# Altium project Intermediate_LCL_Updated.PrjPcb
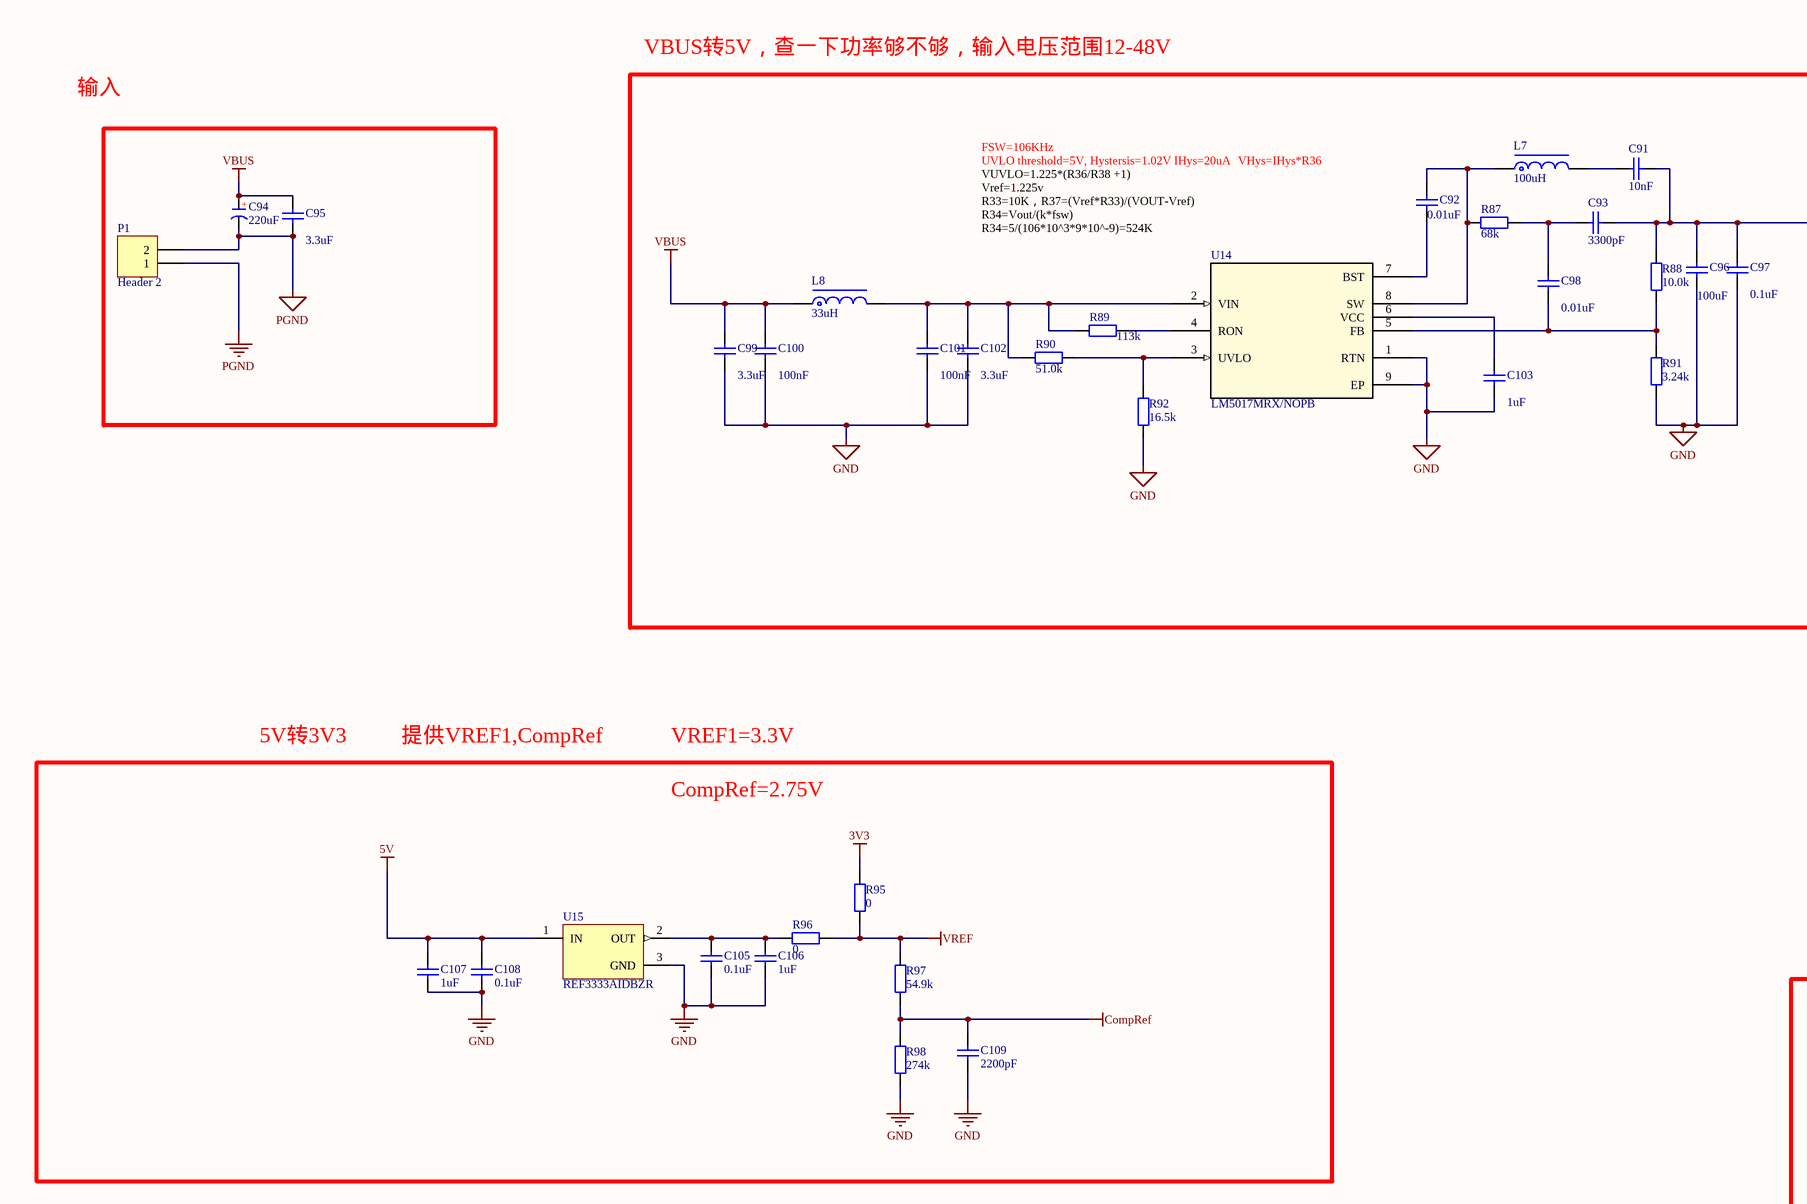
[diagram p0: power.SchDoc, left]
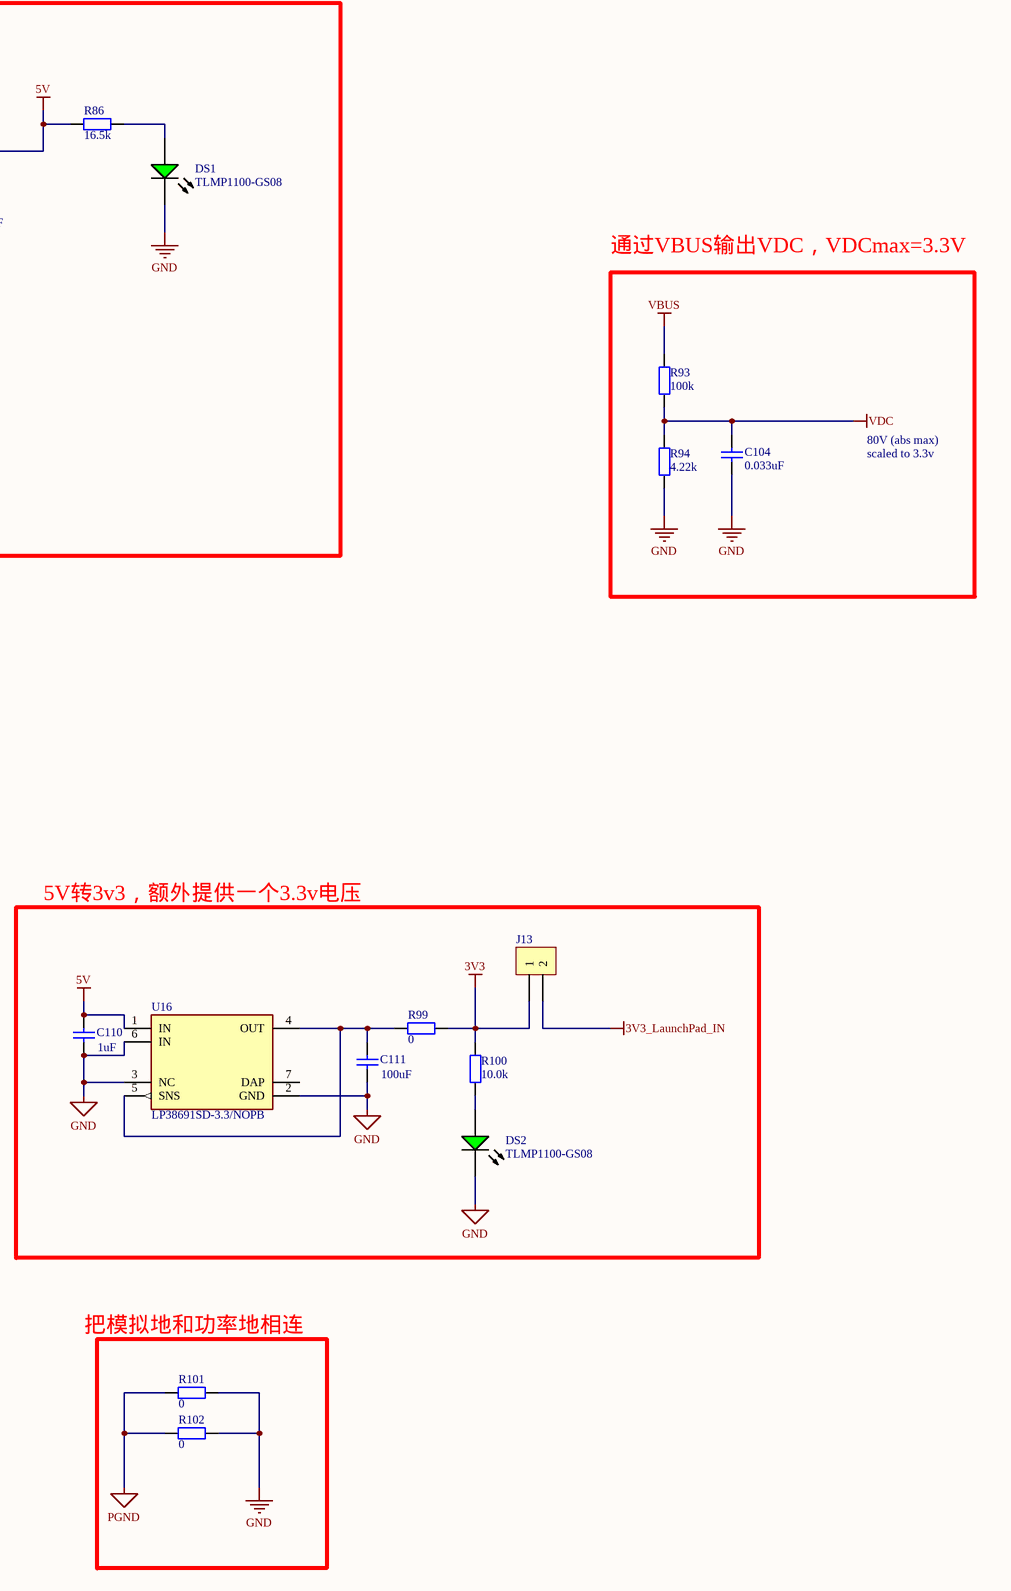
[diagram p1: power.SchDoc, right]
5 sheets, 482 parts. Net scope: hierarchical (ports join the sheet entries above them; power ports are global).
Board file: mini-inverter.PcbDoc
Sheets:
  power.SchDoc
  protection.SchDoc
  pwm-enable.SchDoc
  mini-inverter.SchDoc
    Inverter?1 = bridge.SchDoc
    Inverter?2 = bridge.SchDoc
    Inverter?3 = bridge.SchDoc
    Inverter?1 = bridge.SchDoc
    Inverter?2 = bridge.SchDoc
    Inverter?3 = bridge.SchDoc

## Sheet power.SchDoc
size A2

### Parts
(Parts that share a designator on the sheet are numbered #1, #2 ... from top to bottom, then left to right.)
C91  10nF  [CAPC1608X06N]
C92  0.01uF  [CAPC1608X06N]
C93  3300pF  [CAPC1608X06N]
C94  220uF  [CAP 1.5*4*8]
C95  3.3uF  [CAPC1608X06N]
C96  100uF  [CAPC1608X06N]
C97  0.1uF  [CAPC1608X06N]
C98  0.01uF  [CAPC1608X06N]
C99  3.3uF  [CAPC1608X06N]
C100  100nF  [CAPC1608X06N]
C101  100nF  [CAPC1608X06N]
C102  3.3uF  [CAPC1608X06N]
C103  1uF  [CAPC1608X06N]
C104  0.033uF  [CAPC1608X06N]
C105  0.1uF  [CAPC1608X06N]
C106  1uF  [CAPC1608X06N]
C107  1uF  [CAPC1608X06N]
C108  0.1uF  [CAPC1608X06N]
C109  2200pF  [CAPC1608X06N]
C110  1uF  [CAPC1608X06N]
C111  100uF  [CAPC1608X06N]
DS1  TLMP1100-GS08  [VISH-TLMX1100_V]
DS2  TLMP1100-GS08  [VISH-TLMX1100_V]
J13  CON2  [DG1282-5.0]  (value not drawn)
L7  100uH  [NR4018]
L8  33uH  [NR2520]
P1  Header 2  [HDR1X2]
R86  16.5k  [RESC1608X05N]
R87  68k  [RESC1608X05N]
R88  10.0k  [RESC1608X05N]
R89  113k  [RESC1608X05N]
R90  51.0k  [RESC1608X05N]
R91  3.24k  [RESC1608X05N]
R92  16.5k  [RESC1608X05N]
R93  100k  [RESC1608X05N]
R94  4.22k  [RESC1608X05N]
R95  0  [RESC1608X05N]
R96  0  [RESC1608X05N]
R97  54.9k  [RESC1608X05N]
R98  274k  [RESC1608X05N]
R99  0  [RESC1608X05N]
R100  10.0k  [RESC1608X05N]
R101  0  [RESC1608X05N]
R102  0  [RESC1608X05N]
U14  LM5017MRX/NOPB  [DDA8_3P1X2P41]
U15#1  REF3333AIDBZR  [DBZ0003A_L]
U16  LP38691SD-3.3/NOPB  [FP-NGG0006A-MFG]

### Nets
3V3: J13.1 R95.2 R99.2 R100.2
3V3_LaunchPad_IN: J13.2
5V: C91.2 C93.1 C96.2 C97.2 C107.1 C108.1 C110.2 R86.2 R88.2 U15#1.1(IN) U16.1(IN)
CompRef: C109.1 R97.1 R98.2
GND: C96.1 C97.1 C99.2 C100.2 C101.2 C102.1 C103.1 C104.2 C105.2 C106.2 C107.2 C108.2 C109.2 C110.1 C111.1 DS1.2(K) DS2.2(K) R91.1 R92.1 R94.1 R98.1 R101.1 R102.1 U14.1(RTN) U14.9(EP) U15#1.3(GND) U16.2(GND) U16.3(NC) U16.6(IN)
PGND: C94.2(K) C95.1 P1.1 P1.2 R101.2 R102.2
VBUS: C94.1(A) C95.2 C99.1 C100.1 L8.1 R93.2
VDC: C104.1 R93.1 R94.2
VREF: R95.1 R96.2 R97.2
NetC91_1: C91.1 L7.2
NetC92_1: C92.1 U14.7(BST)
NetC92_2: C92.2 L7.1 R87.2 U14.8(SW)
NetC93_2: C93.2 C98.2 R87.1
NetC98_1: C98.1 R88.1 R91.2 U14.5(FB)
NetC101_1: C101.1 C102.2 L8.2 R89.1 R90.1 U14.2(VIN)
NetC103_2: C103.2 U14.6(VCC)
NetC105_1: C105.1 C106.1 R96.1 U15#1.2(OUT)
NetC111_2: C111.2 R99.1 U16.4(OUT) U16.5(SNS)
NetDS1_1: DS1.1(A) R86.1
NetDS2_1: DS2.1(A) R100.1
NetR89_2: R89.2 U14.4(RON)
NetR90_2: R90.2 R92.2 U14.3(UVLO)

Not connected (* = marked no-connect by the designer): U16 7(DAP)

### Notes on the sheet
- VBUS转5V，查一下功率够不够，输入电压范围12-48V
- 输入
- FSW=106KHz
- UVLO threshold=5V, Hystersis=1.02V IHys=20uA
- Vref=1.225v
- R33=10K，R37=(Vref*R33)/(VOUT-Vref)
- R34=Vout/(k*fsw)
- VUVLO=1.225*(R36/R38 +1)
- VHys=IHys*R36
- R34=5/(106*10^3*9*10^-9)=524K
- 通过VBUS输出VDC，VDCmax=3.3V
- 80V (abs max)
- scaled to 3.3v
- 5V转3V3
- 提供VREF1,CompRef
- VREF1=3.3V
- CompRef=2.75V
- 5V转3v3，额外提供一个3.3v电压
- 把模拟地和功率地相连
- (in symbol CE) +

### Library data of the parts
C91-C93 C95-C111 = Cap: Capacitor; Published: 8-Jun-2000; LatestRevisionDate: 17-Jul-2002; LatestRevisionNote: Re-released for DXP Platform.; PackageReference: RAD-0.3; Publisher: Altium Limited; PackageDescription: Radial Cap, Thru-Hole; 2 Leads; 0.3 in Pin Spacing
  C91: Value: 10nF
  C92 C98: Value: 0.01uF
  C93: Value: 3300pF
  C95 C99 C102: Value: 3.3uF
  C96 C111: Value: 100uF
  C97 C105 C108: Value: 0.1uF
  C100 C101: Value: 100nF
  C103 C106 C107 C110: Value: 1uF
  C104: Value: 0.033uF
  C109: Value: 2200pF
C94 = CE: 直插电解电容; 淘宝ID: 封装库来自淘宝 ID：黄晶宝石; BOM名称: 直插电解电容; 联系售后: https://shop463601444.taobao.com
DS1 DS2 = CMP-1666-00027-1_1: LED, RED, 2.1 V, -40 to 100 degC, 2-Pin SMD (0603), RoHS, Tape and Reel; Type (Capacitors): C0G; Resistance: 100000000000 Ohm; Capacitance: 12 pF; Voltage Rating: 50 V; Tolerance: 5%; Min Operating Temperature: -55degC; REACH SVHC: No SVHC; ComponentLink2Description: Datasheet; ComponentLink1URL: http://www.vishay.com/; Width: 0.8 mm; Package Quantity: 4000; PackageReference: TLMX1100; ComponentLink2URL: http://www.vishay.com/docs/83173/tlmb1100.pdf; Case/Package: 0603; Case Code (Metric): 1608; Packaging: Tape and Reel; Pins: 2; ComponentLink1Description: Manufacturer URL; Max Operating Temperature: 125degC; Height: 0.8 mm; Length: 1.6 mm; Mount: Surface Mount; PackageDescription: 2-Pin Surface Mount Device, Body 1.6 x 0.8 mm; DatasheetVersion: Rev. 2.7, 03/2016; Case Code (Imperial): 0603; Voltage Rating (DC): 50 V; RoHSCompliant: True; Radiation Hardening: No
L7 L8 = L-NR: NR磁胶电感; 版权归属: 来自淘宝 ID：黄晶宝石; BOM名称: NR磁胶电感; 联系售后: https://shop463601444.taobao.com
P1 = Header 2: Header, 2-Pin; LatestRevisionDate: 17-Jul-2002; LatestRevisionNote: Re-released for DXP Platform.; Publisher: Altium Limited
R86-R102 = 0603 100KΩ (1003) 1%_4: 贴片电阻; Value: 1MΩ(1%); ComponentLink1Description: 供应商链接; ComponentLink1URL: http://www.szlcsc.com/product/details_26546.html; Package: 0603; Supplier: LC; SuppliersPartNumber: C25803
U14 = LM5017MRXNOPB: No Description Available; Mfr_Name: Texas Instruments; Copyright: Copyright (C) 2024 Ultra Librarian. All rights reserved.; Manufacturer_Part_Number: LM5017MRX/NOPB; RefDes: RefDes; Type: DEV
U15#1 = CMP-0367-00146-2: 30 ppm / degC Drift, 3.9 uA Voltage Reference, -40 to 125 degC, 3-pin SOT-23 (DBZ), Green (RoHS & no Sb/Br); Manufacturer: Texas Instruments; Temp Coeff(Typ)(ppm/ degree C): 8; Rating: Catalog; VO(V): 3.3; VI(Max)(V): 5.5; SubFamily: Series Voltage Reference; Iq(Max)(uA): 5; VI(Min)(V): 3.5; Temp Coeff(Max)(ppm/ degree C): 30; Initial Accuracy @ 25/deg C(%): 0.15; ComponentLink2URL: http://www.ti.com/general/docs/lit/getliterature.tsp?genericPartNumber=REF3333&fileType=pdf; ComponentLink3URL: http://www.ti.com/litv/pdf/mpds108a; Eco-Plan: Green (RoHS & no Sb/Br); ComponentLink1URL: http://www.ti.com/; Mounting Technology: Surface Mount; PartNumber: REF3333AIDBZR; ComponentLink2Description: Datasheet; PackageReference: DBZ0003A; ComponentLink4Description: URL Link1; PackageDescription: 3-Pin Plastic Small Outline, Body 2.92 x 1.3 mm, Pitch 0.95 mm; ComponentLink1Description: Manufacturer URL; Code_JEDEC: TO-236; ComponentLink3Description: Package Specification; PackageVersion: 4203227/B; ComponentLink4URL: Samples URL:http://www.ti.com/product/ref3333; DatasheetVersion: SBOS392A; Iout/Iz(Max)(mA): 5
U16 = CMP-0062-01590-5: IC REG LINEAR 3.3V 500MA 6WSON; Min Input Voltage: 2.7V; Number of Regulators: 1; Polarity: Positive; Dropout Voltage: 330mV; Output Type: Fixed; Output Voltage Accuracy: 2%; Max Input Voltage: 10V; Quiescent Current: 100uA; Max Output Current: 500mA; Output Current: 500mA; Package Quantity: 1000; Nominal Output Voltage: 3.3V; Number of Pins: 6; Number of Outputs: 1; Length: 3mm; Output Voltage: 3.3V; Height: 0.86mm; REACH SVHC: No SVHC; Accuracy: 2%; Lead Free: Lead Free; Mount: Surface Mount; Packaging: Tape and Reel; Contact Plating: Tin; Max Operating Temperature: 125°C; Min Operating Temperature: -40°C; Radiation Hardening: No; Width: 3mm

## Sheet protection.SchDoc
size A4
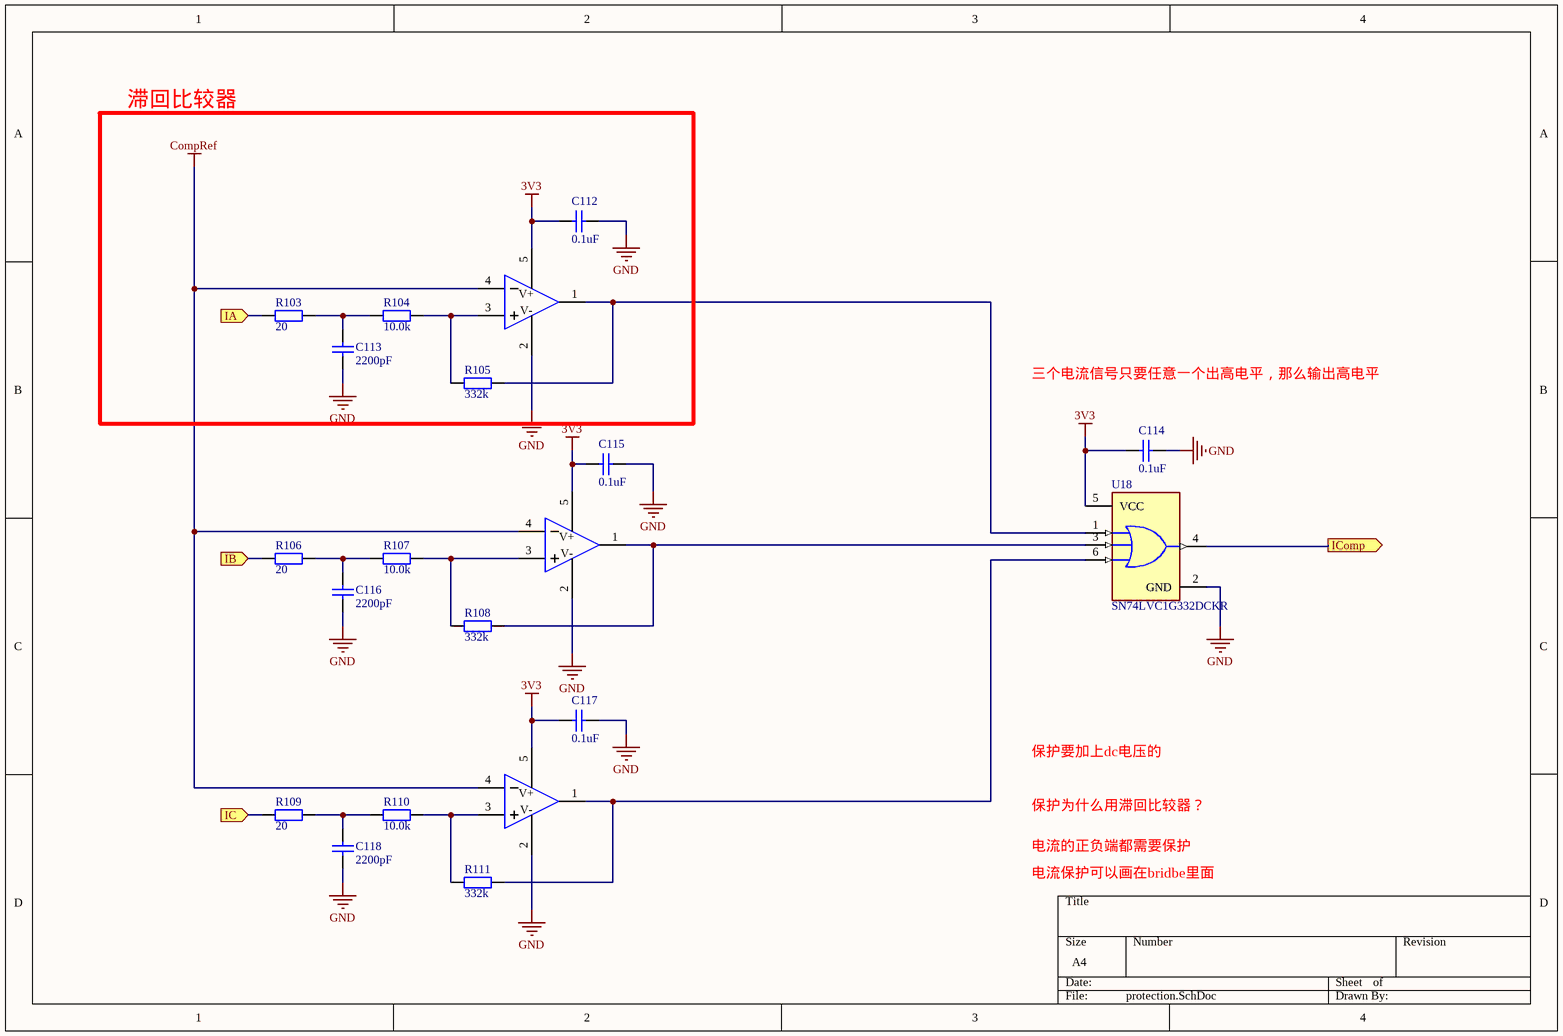
[diagram p2: protection.SchDoc]

### Parts
(Parts that share a designator on the sheet are numbered #1, #2 ... from top to bottom, then left to right.)
C112  0.1uF  [CAPC1608X06N]
C113  2200pF  [CAPC1608X06N]
C114  0.1uF  [CAPC1608X06N]
C115  0.1uF  [CAPC1608X06N]
C116  2200pF  [CAPC1608X06N]
C117  0.1uF  [CAPC1608X06N]
C118  2200pF  [CAPC1608X06N]
R103  20  [RESC1608X05N]
R104  10.0k  [RESC1608X05N]
R105  332k  [RESC1608X05N]
R106  20  [RESC1608X05N]
R107  10.0k  [RESC1608X05N]
R108  332k  [RESC1608X05N]
R109  20  [RESC1608X05N]
R110  10.0k  [RESC1608X05N]
R111  332k  [RESC1608X05N]
U17#1  TLV3201AIDBVR  [SOT-23-5_L3.0-W1.7-P0.95-LS2.8-BR]  (value not drawn)
U18  SN74LVC1G332DCKR  [FP-DCK0006A-MFG]
U19  TLV3201AIDBVR  [SOT-23-5_L3.0-W1.7-P0.95-LS2.8-BR]  (value not drawn)
U20  TLV3201AIDBVR  [SOT-23-5_L3.0-W1.7-P0.95-LS2.8-BR]  (value not drawn)

### Ports
IA (in), IB (in), IC (in), IComp (out)

### Nets
3V3: C112.1 C114.1 C115.1 C117.1 U17#1.5(VCC) U18.5(VCC) U19.5(VCC) U20.5(VCC)
CompRef: U17#1.4(IN-) U19.4(IN-) U20.4(IN-)
GND: C112.2 C113.2 C114.2 C115.2 C116.2 C117.2 C118.2 U17#1.2(GND) U18.2(GND) U19.2(GND) U20.2(GND)
NetC113_1: C113.1 R103.1 R104.2
NetC116_1: C116.1 R106.1 R107.2
NetC118_1: C118.1 R109.1 R110.2
NetR103_2: R103.2 ; port IA
NetR104_1: R104.1 R105.2 U17#1.3(IN+)
NetR105_1: R105.1 U17#1.1(OUT) U18.1(A)
NetR106_2: R106.2 ; port IB
NetR107_1: R107.1 R108.2 U19.3(IN+)
NetR108_1: R108.1 U18.3(B) U19.1(OUT)
NetR109_2: R109.2 ; port IC
NetR110_1: R110.1 R111.2 U20.3(IN+)
NetR111_1: R111.1 U18.6(C) U20.1(OUT)
NetU18_4: U18.4(Y) ; port IComp

### Notes on the sheet
- 滞回比较器
- 三个电流信号只要任意一个出高电平，那么输出高电平
- 保护要加上dc电压的
- 保护为什么用滞回比较器？
- 电流的正负端都需要保护
- 电流保护可以画在bridbe里面
- (in symbol TLV3201AIDBVR) V+; V-

### Library data of the parts
C112-C118 = Cap: Capacitor; Published: 8-Jun-2000; LatestRevisionDate: 17-Jul-2002; LatestRevisionNote: Re-released for DXP Platform.; PackageReference: RAD-0.3; Publisher: Altium Limited; PackageDescription: Radial Cap, Thru-Hole; 2 Leads; 0.3 in Pin Spacing
  C112 C114 C115 C117: Value: 0.1uF
  C113 C116 C118: Value: 2200pF
R103-R111 = 0603 100KΩ (1003) 1%_4: 贴片电阻; Value: 1MΩ(1%); ComponentLink1Description: 供应商链接; ComponentLink1URL: http://www.szlcsc.com/product/details_26546.html; Package: 0603; Supplier: LC; SuppliersPartNumber: C25803
U17#1 U19 U20 = TLV3201AIDBVR: Manufacturer: TI(德州仪器); Add into BOM: yes; Input Offset Voltage (Vos): 1mV; Input Bias Current (Ib): 5nA; Propagation Delay Time: 40ns; Input Hysteresis Voltage (Vhys): 1.2mV; Common Mode Rejection Ratio (CMRR): 70dB; Supply Voltage: 2.7V~5.5V; Output Type: 推挽; Supply Current: 40uA; Symbol: TLV3201AIDBVR; Device: TLV3201AIDBVR; LCSC Part Name: TLV3201AIDBVR; Supplier Part: C105188; Manufacturer Part: TLV3201AIDBVR; Supplier Footprint: SOT-23-5; JLCPCB Part Class: Extended Part; Datasheet: https://www.ti.com/cn/lit/gpn/tlv3201; Supplier: LCSC; Convert to PCB: yes; Output Mode: -; Rail-to-Rail: -; Operating Temperature: -40℃~+125℃
U18 = CMP-0859-00464-4: IC GATE OR 1CH 3-INP SC70-6; Manufacturer: Texas Instruments; Min Supply Voltage: 1.65V; Number Of Circuits: 1; Nominal Supply Current: 10uA; Number Of Inputs: 3; Max Supply Voltage: 5.5V; Propagation Delay: 20ns; Standoff Height: 0mm; Logic Function Desc: Non-Inverting; Manufacturer Part Number: SN74LVC1G332DCKR; Automotive: No; Temperature: -40°C to +125°C; Device Class L1: Integrated Circuits (ICs); ComponentLink2URL: http://www.ti.com/lit/ds/symlink/sn74lvc1g332.pdf; RoHS: TRUE; Digikey Description: IC GATE OR 1CH 3-INP SC70-6; Octopart: https://octopart.com/sn74lvc1g332dckr-texas+instruments-464861; Ambient Temperature Range Low: -40°C; Number Of Outputs: 1; Height: 1.1mm; Device Class L2: Logic ICs; Mouser Description: Logic Gates Single 3-Input Pos- OR Gate; ComponentLink2Description: Datasheet; Package: DCK0006A; Temperature Range Low: -40°C; Ambient Temperature Range High: +125°C; Temperature Range High: +125°C; Category: IC; Device Class L3: Logic Gates; Lead Free: Yes

## Sheet pwm-enable.SchDoc
size A3
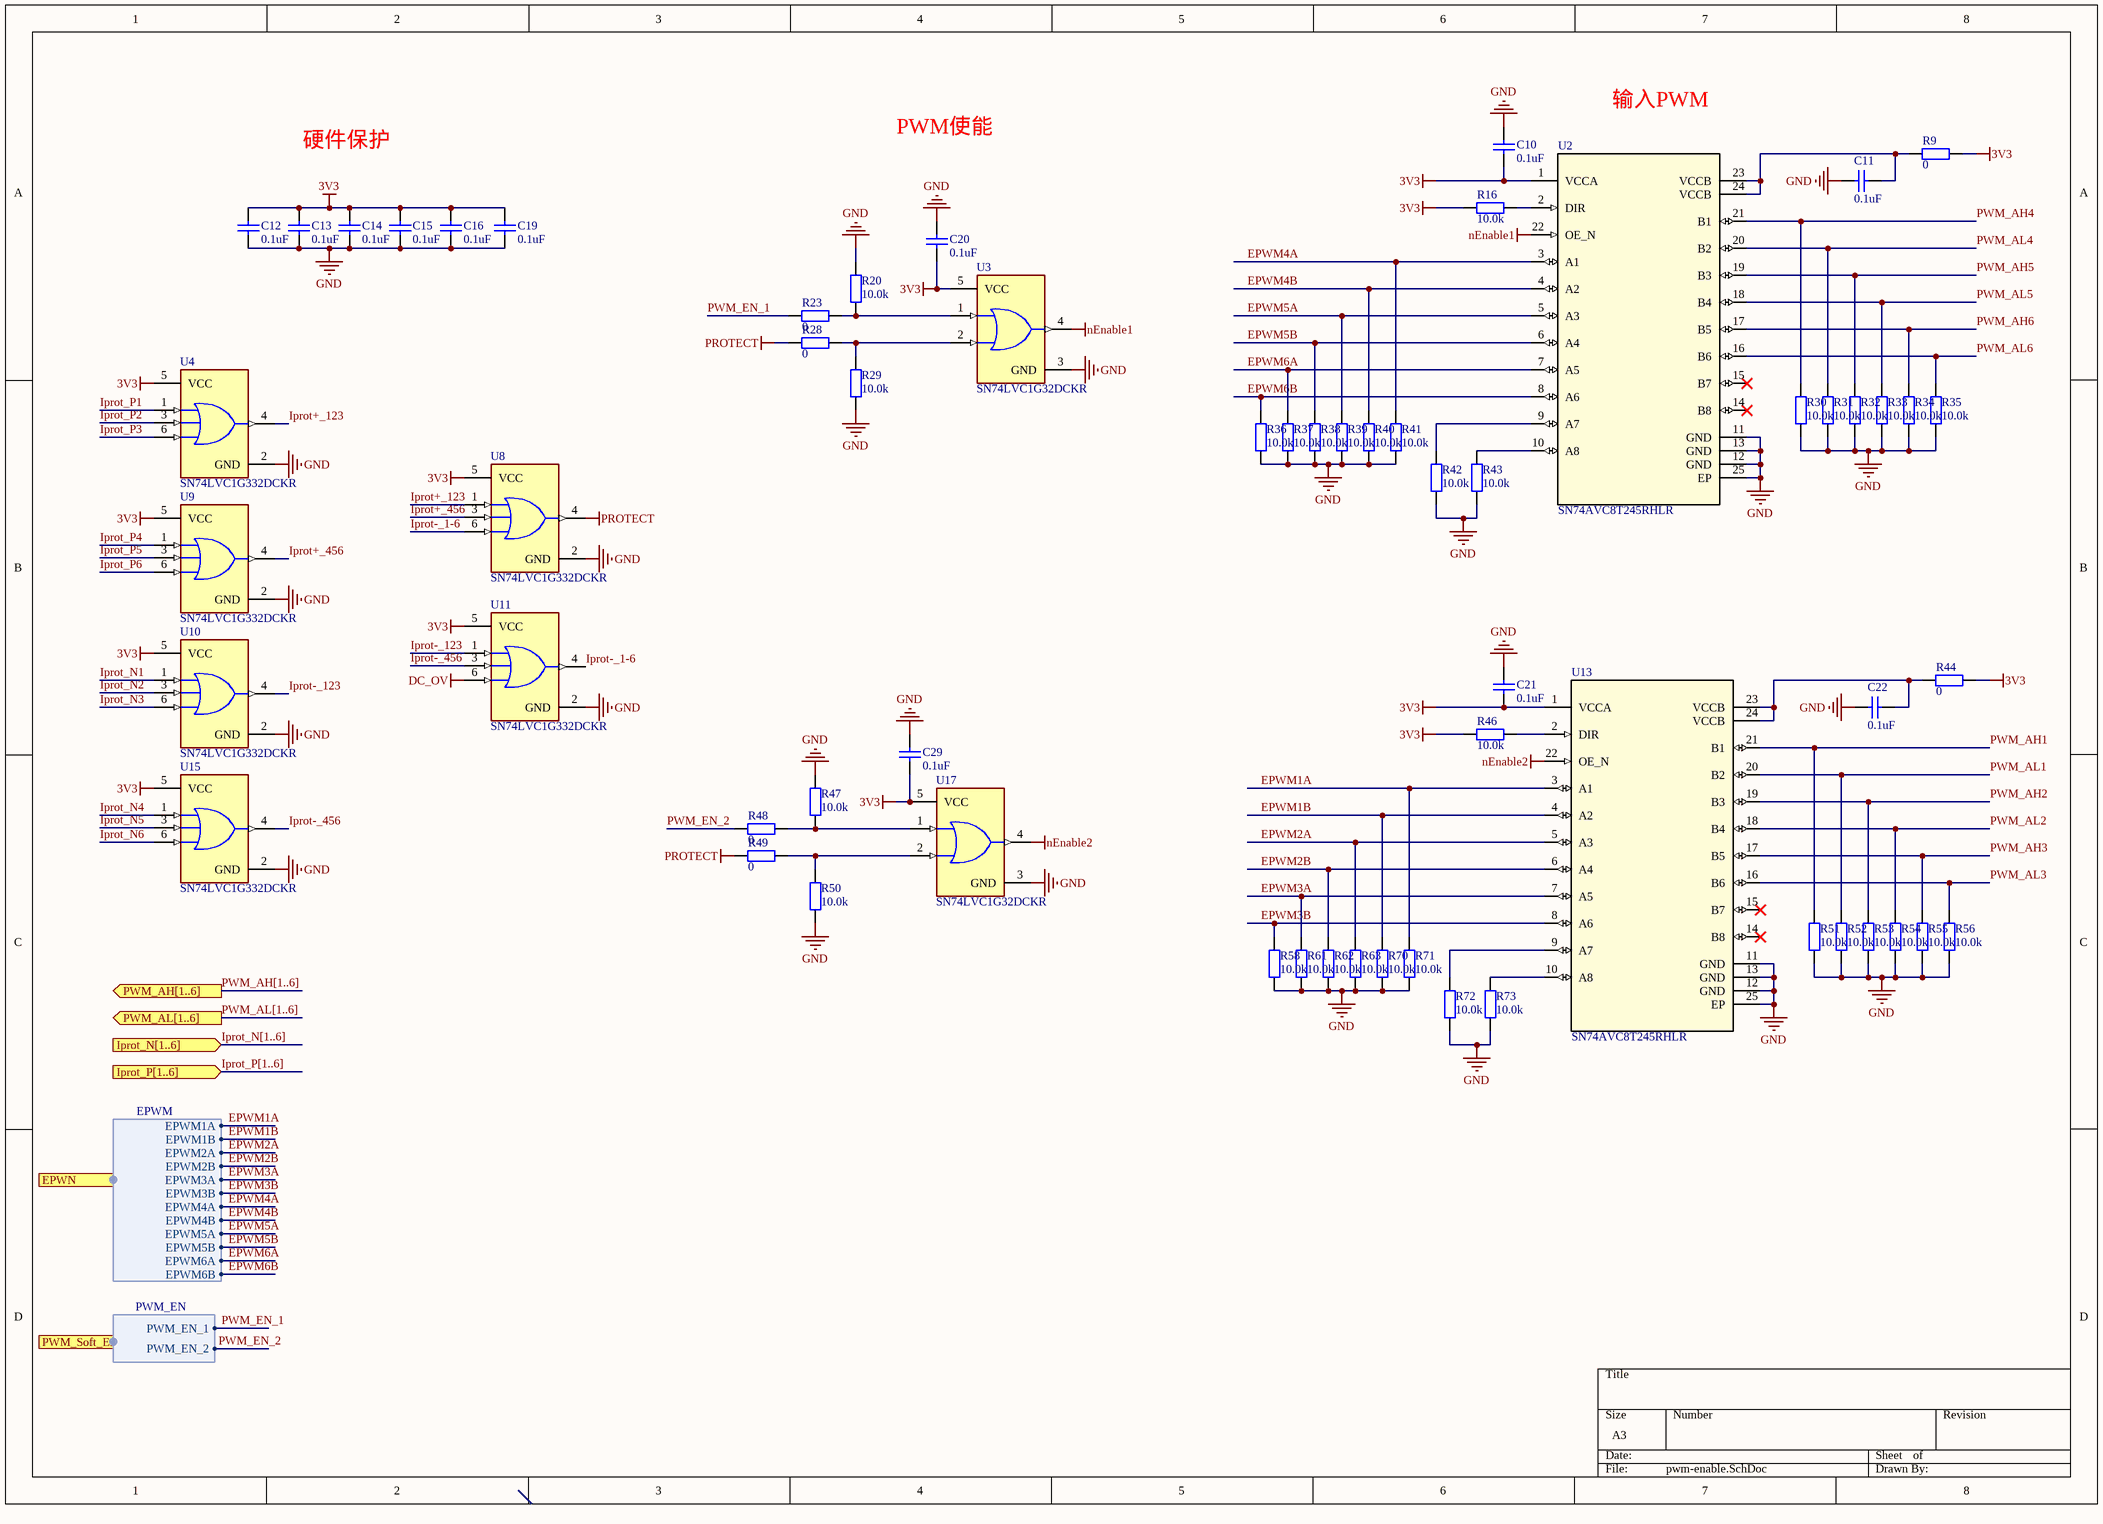
[diagram p3: pwm-enable.SchDoc]

### Parts
(Parts that share a designator on the sheet are numbered #1, #2 ... from top to bottom, then left to right.)
C10  0.1uF  [CAPC1608X06N]
C11  0.1uF  [CAPC1608X06N]
C12  0.1uF  [CAPC1608X06N]
C13  0.1uF  [CAPC1608X06N]
C14  0.1uF  [CAPC1608X06N]
C15  0.1uF  [CAPC1608X06N]
C16  0.1uF  [CAPC1608X06N]
C19  0.1uF  [CAPC1608X06N]
C20  0.1uF  [CAPC1608X06N]
C21  0.1uF  [CAPC1608X06N]
C22  0.1uF  [CAPC1608X06N]
C29  0.1uF  [CAPC1608X06N]
R9  0  [RESC1608X05N]
R16  10.0k  [RESC1608X05N]
R20  10.0k  [RESC1608X05N]
R23  0  [RESC1608X05N]
R28  0  [RESC1608X05N]
R29  10.0k  [RESC1608X05N]
R30  10.0k  [RESC1608X05N]
R31#1  10.0k  [RESC1608X05N]
R32#1  10.0k  [RESC1608X05N]
R33  10.0k  [RESC1608X05N]
R34  10.0k  [RESC1608X05N]
R35  10.0k  [RESC1608X05N]
R36  10.0k  [RESC1608X05N]
R37  10.0k  [RESC1608X05N]
R38  10.0k  [RESC1608X05N]
R39  10.0k  [RESC1608X05N]
R40  10.0k  [RESC1608X05N]
R41  10.0k  [RESC1608X05N]
R42  10.0k  [RESC1608X05N]
R43  10.0k  [RESC1608X05N]
R44  0  [RESC1608X05N]
R46  10.0k  [RESC1608X05N]
R47  10.0k  [RESC1608X05N]
R48  0  [RESC1608X05N]
R49  0  [RESC1608X05N]
R50  10.0k  [RESC1608X05N]
R51  10.0k  [RESC1608X05N]
R52  10.0k  [RESC1608X05N]
R53  10.0k  [RESC1608X05N]
R54  10.0k  [RESC1608X05N]
R55  10.0k  [RESC1608X05N]
R56  10.0k  [RESC1608X05N]
R58  10.0k  [RESC1608X05N]
R61  10.0k  [RESC1608X05N]
R62  10.0k  [RESC1608X05N]
R63  10.0k  [RESC1608X05N]
R70  10.0k  [RESC1608X05N]
R71  10.0k  [RESC1608X05N]
R72  10.0k  [RESC1608X05N]
R73  10.0k  [RESC1608X05N]
U2  SN74AVC8T245RHLR  [RHL0024A]
U3  SN74LVC1G32DCKR  [FP-DCK0005A-IPC_A]
U4  SN74LVC1G332DCKR  [FP-DCK0006A-MFG]
U8  SN74LVC1G332DCKR  [FP-DCK0006A-MFG]
U9  SN74LVC1G332DCKR  [FP-DCK0006A-MFG]
U10  SN74LVC1G332DCKR  [FP-DCK0006A-MFG]
U11  SN74LVC1G332DCKR  [FP-DCK0006A-MFG]
U13  SN74AVC8T245RHLR  [RHL0024A]
U15#2  SN74LVC1G332DCKR  [FP-DCK0006A-MFG]
U17#2  SN74LVC1G32DCKR  [FP-DCK0005A-IPC_A]

### Ports
EPWN (harness EPWM), Iprot_N[1..6] (in), Iprot_P[1..6] (in), PWM_AH[1..6] (out), PWM_AL[1..6] (out), PWM_Soft_Enable (harness PWM_EN)

### Harnesses
EPWM: EPWM1A, EPWM2A, EPWM2B, EPWM3A, EPWM3B, EPWM1B, EPWM4A, EPWM4B, EPWM5A, EPWM5B, EPWM6A, EPWM6B
PWM_EN: PWM_EN_1, PWM_EN_2

### Nets
3V3: C10.1 C12.1 C13.1 C14.1 C15.1 C16.1 C19.1 C20.1 C21.1 C29.1 R9.2 R16.1 R44.2 R46.1 U2.1(VCCA) U3.5(VCC) U4.5(VCC) U8.5(VCC) U9.5(VCC) U10.5(VCC) U11.5(VCC) U13.1(VCCA) U15#2.5(VCC) U17#2.5(VCC)
DC_OV: U11.6(C)
GND: C10.2 C11.2 C12.2 C13.2 C14.2 C15.2 C16.2 C19.2 C20.2 C21.2 C22.2 C29.2 R20.1 R29.1 R30.2 R31#1.2 R32#1.2 R33.2 R34.2 R35.2 R36.1 R37.1 R38.1 R39.2 R40.1 R41.1 R42.2 R43.2 R47.1 R50.1 R51.2 R52.2 R53.2 R54.2 R55.2 R56.2 R58.1 R61.1 R62.1 R63.2 R70.1 R71.1 R72.2 R73.2 U2.11(GND) U2.12(GND) U2.13(GND) U2.25(EP) U3.3(GND) U4.2(GND) U8.2(GND) U9.2(GND) U10.2(GND) U11.2(GND) U13.11(GND) U13.12(GND) U13.13(GND) U13.25(EP) U15#2.2(GND) U17#2.3(GND)
nEnable1: U2.22(OE_N) U3.4(Y)
nEnable2: U13.22(OE_N) U17#2.4(Y)
PROTECT: R28.1 R49.1 U8.4(Y)
EPWM1A: R71.2 U13.3(A1) ; port EPWN.EPWM1A
EPWM1B: R70.2 U13.4(A2) ; port EPWN.EPWM1B
EPWM2A: R63.1 U13.5(A3) ; port EPWN.EPWM2A
EPWM2B: R62.2 U13.6(A4) ; port EPWN.EPWM2B
EPWM3A: R61.2 U13.7(A5) ; port EPWN.EPWM3A
EPWM3B: R58.2 U13.8(A6) ; port EPWN.EPWM3B
EPWM4A: R41.2 U2.3(A1) ; port EPWN.EPWM4A
EPWM4B: R40.2 U2.4(A2) ; port EPWN.EPWM4B
EPWM5A: R39.1 U2.5(A3) ; port EPWN.EPWM5A
EPWM5B: R38.2 U2.6(A4) ; port EPWN.EPWM5B
EPWM6A: R37.2 U2.7(A5) ; port EPWN.EPWM6A
EPWM6B: R36.2 U2.8(A6) ; port EPWN.EPWM6B
Iprot+_123: U4.4(Y) U8.1(A)
Iprot+_456: U8.3(B) U9.4(Y)
Iprot-_1-6: U8.6(C) U11.4(Y)
Iprot-_123: U10.4(Y) U11.1(A)
Iprot-_456: U11.3(B) U15#2.4(Y)
Iprot_N1: U10.1(A)
Iprot_N2: U10.3(B)
Iprot_N3: U10.6(C)
Iprot_N4: U15#2.1(A)
Iprot_N5: U15#2.3(B)
Iprot_N6: U15#2.6(C)
Iprot_P1: U4.1(A)
Iprot_P2: U4.3(B)
Iprot_P3: U4.6(C)
Iprot_P4: U9.1(A)
Iprot_P5: U9.3(B)
Iprot_P6: U9.6(C)
PWM_AH1: R51.1 U13.21(B1)
PWM_AH2: R53.1 U13.19(B3)
PWM_AH3: R55.1 U13.17(B5)
PWM_AH4: R30.1 U2.21(B1)
PWM_AH5: R32#1.1 U2.19(B3)
PWM_AH6: R34.1 U2.17(B5)
PWM_AL1: R52.1 U13.20(B2)
PWM_AL2: R54.1 U13.18(B4)
PWM_AL3: R56.1 U13.16(B6)
PWM_AL4: R31#1.1 U2.20(B2)
PWM_AL5: R33.1 U2.18(B4)
PWM_AL6: R35.1 U2.16(B6)
PWM_EN_1: R23.1 ; port PWM_Soft_Enable.PWM_EN_1
PWM_EN_2: R48.1 ; port PWM_Soft_Enable.PWM_EN_2
NetC11_1: C11.1 R9.1 U2.23(VCCB) U2.24(VCCB)
NetC22_1: C22.1 R44.1 U13.23(VCCB) U13.24(VCCB)
NetR16_2: R16.2 U2.2(DIR)
NetR20_2: R20.2 R23.2 U3.1(A)
NetR28_2: R28.2 R29.2 U3.2(B)
NetR42_1: R42.1 U2.9(A7)
NetR43_1: R43.1 U2.10(A8)
NetR46_2: R46.2 U13.2(DIR)
NetR47_2: R47.2 R48.2 U17#2.1(A)
NetR49_2: R49.2 R50.2 U17#2.2(B)
NetR72_1: R72.1 U13.9(A7)
NetR73_1: R73.1 U13.10(A8)

Not connected (* = marked no-connect by the designer): U2 14(B8)* 15(B7)*; U13 14(B8)* 15(B7)*

### Buses and harness runs
bus Iprot_N[1..6] = port Iprot_N[1..6]
bus Iprot_P[1..6] = port Iprot_P[1..6]
bus PWM_AH[1..6] = port PWM_AH[1..6]
bus PWM_AL[1..6] = port PWM_AL[1..6]

### Notes on the sheet
- 输入PWM
- 硬件保护
- PWM使能

### Library data of the parts
C10-C16 C19-C22 C29 = Cap: Capacitor; Published: 8-Jun-2000; LatestRevisionDate: 17-Jul-2002; LatestRevisionNote: Re-released for DXP Platform.; PackageReference: RAD-0.3; Publisher: Altium Limited; PackageDescription: Radial Cap, Thru-Hole; 2 Leads; 0.3 in Pin Spacing; Value: 0.1uF
R9 R44 = Res: Resistor 0402; Value: K; Published: 8-Jun-2000; LatestRevisionDate: 17-Jul-2002; LatestRevisionNote: Re-released for DXP Platform.; PackageReference: AXIAL-0.4; Publisher: Altium Limited; PackageDescription: Axial Device, Thru-Hole; 2 Leads; 0.4 in Pin Spacing
R16 R20 R23 R28-R30 R31#1 R32#1 R33-R43 R46-R56 R58 R61-R63 R70-R73 = 0603 100KΩ (1003) 1%_4: 贴片电阻; Value: 1MΩ(1%); ComponentLink1Description: 供应商链接; ComponentLink1URL: http://www.szlcsc.com/product/details_26546.html; Package: 0603; Supplier: LC; SuppliersPartNumber: C25803
U2 = SN74AVC8T245RHLR: No Description Available(1.2-3.6V); Mfr_Name: Texas Instruments; CompType: IC; Type: DEV; RefDes: RefDes; Copyright: Copyright (C) 2024 Ultra Librarian. All rights reserved.; Manufacturer_Part_Number: SN74AVC8T245RHLR; PartNumber: SN74AVC8T245RHL; PackageReference: RHL0024A; MountType: SMT; RoHS: Y; Manufacturer: Texas Instruments
U3 U17#2 = CMP-0859-00376-4: IC GATE OR 1CH 2-INP SC70-5(1.65-5.5V); Turn-On Delay Time: 4.5ns; Schmitt Trigger Input: No; Number of Bits: 1; High Level Output Current: -32mA; Max Supply Voltage: 5.5V; Propagation Delay: 4ns; Max Output Current: 32mA; Min Supply Voltage: 1.65V; Number of Input Lines: 2; Quiescent Current: 10uA; Case/Package: SC; Weight: 8.8E-05oz; Logic Function: OR; Package Quantity: 1; Packaging: Tape and Reel; Mount: Surface Mount; Max Operating Temperature: 125°C; Output Current: 32mA; Length: 2mm; Contact Plating: Gold; Number of Output Lines: 1; Height: 0.9mm; Number of Pins: 5; Width: 1.25mm; REACH SVHC: No SVHC; Number of Circuits: 1; Radiation Hardening: No; Number of Elements: 1; Low Level Output Current: 32mA; Number of Outputs: 1; Min Operating Temperature: -40°C; Number of Inputs: 2; Lead Free: Lead Free; Termination: SMD/SMT; Number of Gates: 1
U4 U8-U11 U15#2 = CMP-0859-00464-4: as U18 on sheet protection; Manufacturer Part Number: SN74LVC1G332DCKR; Automotive: No; Temperature: -40°C to +125°C; Device Class L1: Integrated Circuits (ICs); ComponentLink2URL: http://www.ti.com/lit/ds/symlink/sn74lvc1g332.pdf; RoHS: TRUE; Digikey Description: IC GATE OR 1CH 3-INP SC70-6; Octopart: https://octopart.com/sn74lvc1g332dckr-texas+instruments-464861; Ambient Temperature Range Low: -40°C; Number Of Outputs: 1; Height: 1.1mm; Device Class L2: Logic ICs; Mouser Description: Logic Gates Single 3-Input Pos- OR Gate; ComponentLink2Description: Datasheet; Package: DCK0006A; Temperature Range Low: -40°C; Ambient Temperature Range High: +125°C; Temperature Range High: +125°C; Category: IC; Device Class L3: Logic Gates; Lead Free: Yes
U13 = SN74AVC8T245RHLR: No Description Available; Mfr_Name: Texas Instruments; CompType: IC; Type: DEV; RefDes: RefDes; Copyright: Copyright (C) 2024 Ultra Librarian. All rights reserved.; Manufacturer_Part_Number: SN74AVC8T245RHLR; PartNumber: SN74AVC8T245RHL; PackageReference: RHL0024A; MountType: SMT; RoHS: Y; Manufacturer: Texas Instruments

## Sheet mini-inverter.SchDoc
size A1; SheetNumber: 1; SheetTotal: 5
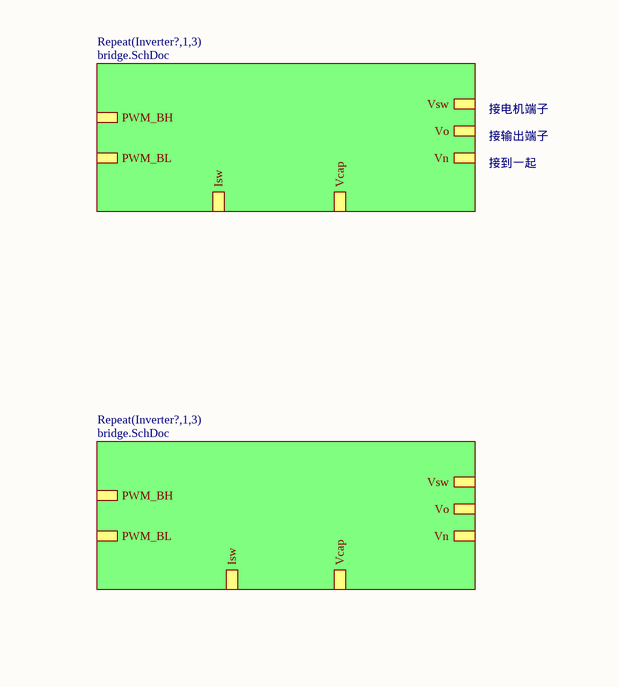
[diagram p4: mini-inverter.SchDoc, top left]
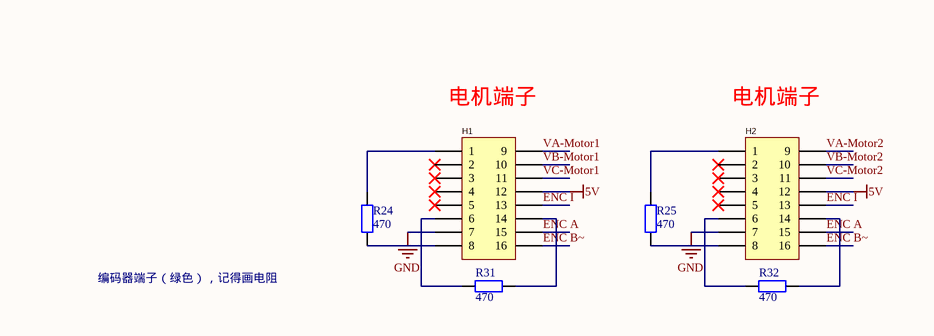
[diagram p5: mini-inverter.SchDoc, top right]
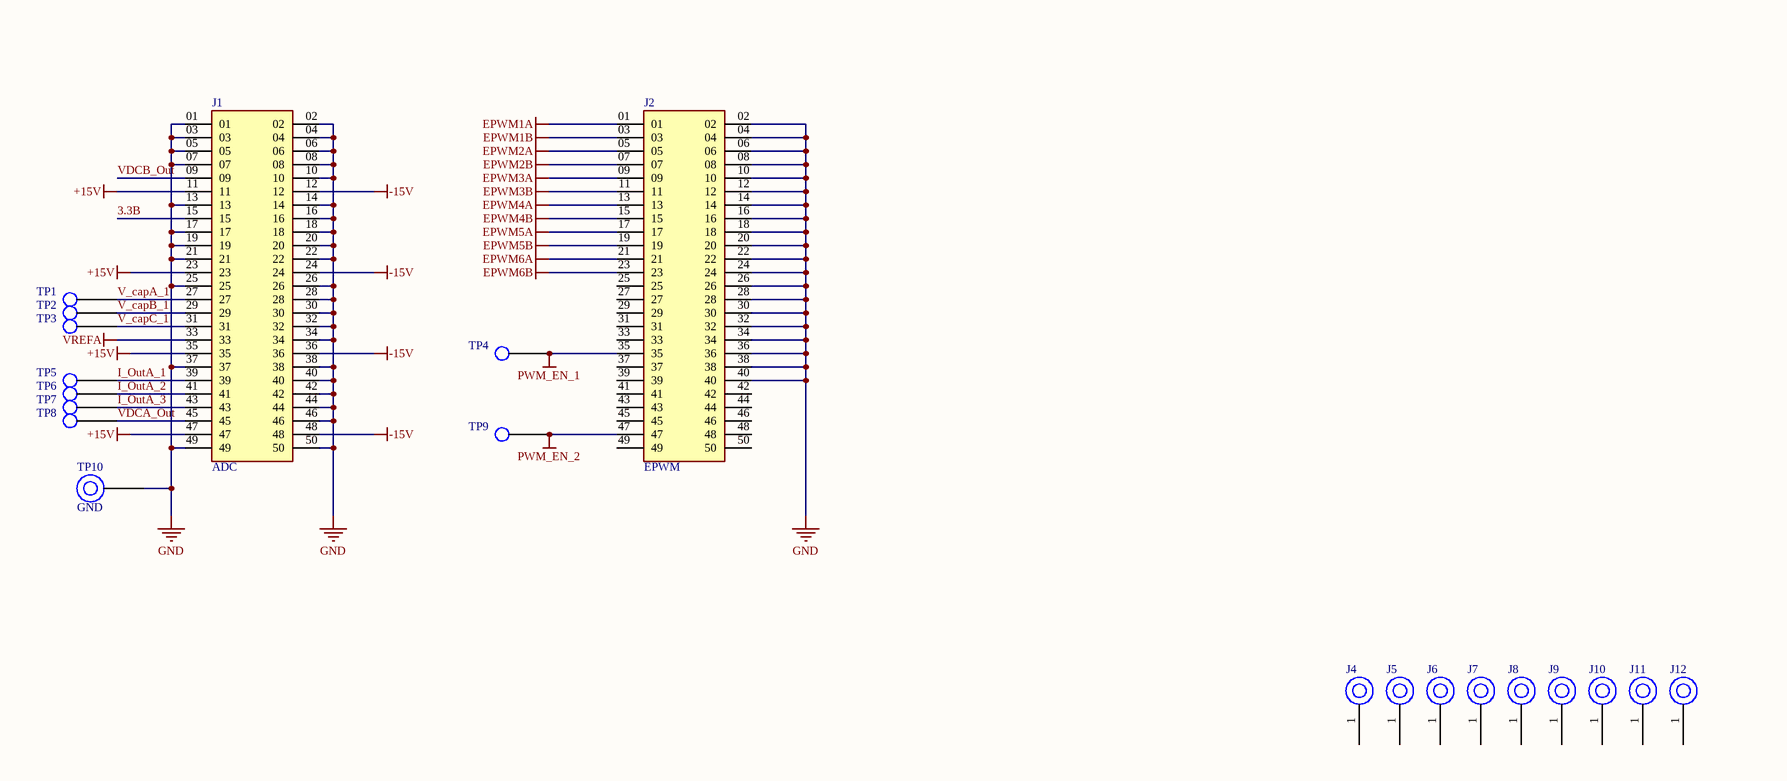
[diagram p6: mini-inverter.SchDoc, bottom left]
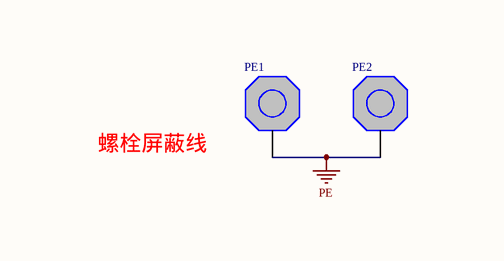
[diagram p7: mini-inverter.SchDoc, bottom right]

### Parts
(Parts that share a designator on the sheet are numbered #1, #2 ... from top to bottom, then left to right.)
H1  HC-5557-2*8AW  [CONN-TH_16P-P4.20_5557-2X8AW]  (value not drawn)
H2  HC-5557-2*8AW  [CONN-TH_16P-P4.20_5557-2X8AW]  (value not drawn)
J1  ADC  [SHF-125-01-L-D-RA]
J2  EPWM  [SHF-125-01-L-D-RA]
J4  M5 Mounting Hole  [M5 Mounting Hole]  (value not drawn)
J5  M5 Mounting Hole  [M5 Mounting Hole]  (value not drawn)
J6  M5 Mounting Hole  [M5 Mounting Hole]  (value not drawn)
J7  M5 Mounting Hole  [M5 Mounting Hole]  (value not drawn)
J8  M5 Mounting Hole  [M5 Mounting Hole]  (value not drawn)
J9  M5 Mounting Hole  [M5 Mounting Hole]  (value not drawn)
J10  M5 Mounting Hole  [M5 Mounting Hole]  (value not drawn)
J11  M5 Mounting Hole  [M5 Mounting Hole]  (value not drawn)
J12  M5 Mounting Hole  [M5 Mounting Hole]  (value not drawn)
PE1  PE  [PE1]  (value not drawn)
PE2  PE  [PE1]  (value not drawn)
R24  470  [RESC1608X05N]
R25  470  [RESC1608X05N]
R31#2  470  [RESC1608X05N]
R32#2  470  [RESC1608X05N]
TP1  VC_1A  [PCB 1.32mm TestPoint]  (value not drawn)
TP2  VC_1B  [PCB 1.32mm TestPoint]  (value not drawn)
TP3  VC_1C  [PCB 1.32mm TestPoint]  (value not drawn)
TP4  PWMEN1  [PCB 1.32mm TestPoint]  (value not drawn)
TP5  I1  [PCB 1.32mm TestPoint]  (value not drawn)
TP6  I2  [PCB 1.32mm TestPoint]  (value not drawn)
TP7  I3  [PCB 1.32mm TestPoint]  (value not drawn)
TP8  VDC  [PCB 1.32mm TestPoint]  (value not drawn)
TP9  PWMEN2  [PCB 1.32mm TestPoint]  (value not drawn)
TP10  GND  [1.9mm Hole]

### Sub-sheets
Repeat(Inverter?,1,3) = bridge.SchDoc: PWM_BH, PWM_BL, Vsw, Vo, Vn, Vcap, Isw
Repeat(Inverter?,1,3) = bridge.SchDoc: PWM_BH, PWM_BL, Vsw, Vo, Vn, Vcap, Isw

### Nets
5V: H1.8(12) H2.8(12)
+15V: J1.11 J1.23 J1.35 J1.47
-15V: J1.12 J1.24 J1.36 J1.48
EPWM1A: J2.01
EPWM1B: J2.03
EPWM2A: J2.05
EPWM2B: J2.07
EPWM3A: J2.09
EPWM3B: J2.11
EPWM4A: J2.13
EPWM4B: J2.15
EPWM5A: J2.17
EPWM5B: J2.19
EPWM6A: J2.21
EPWM6B: J2.23
GND: H1.13(7) H2.13(7) J1.01 J1.02 J1.03 J1.04 J1.05 J1.06 J1.07 J1.08 J1.10 J1.13 J1.14 J1.16 J1.17 J1.18 J1.19 J1.20 J1.21 J1.22 J1.25 J1.26 J1.28 J1.30 J1.32 J1.34 J1.37 J1.38 J1.40 J1.42 J1.44 J1.46 J1.49 J1.50 J2.02 J2.04 J2.06 J2.08 J2.10 J2.12 J2.14 J2.16 J2.18 J2.20 J2.22 J2.24 J2.26 J2.28 J2.30 J2.32 J2.34 J2.36 J2.38 J2.40 TP10.1
PE: PE1.1(PE) PE2.1(PE)
PWM_EN_1: J2.35 TP4.1
PWM_EN_2: J2.47 TP9.1
VREFA: J1.33
3.3B: J1.15
ENC A: H1.14(15) H2.14(15)
ENC B~: H1.16 H2.16
ENC I: H1.10(13) H2.10(13)
I_OutA_1: J1.39 TP5.1
I_OutA_2: J1.41 TP6.1
I_OutA_3: J1.43 TP7.1
V_capA_1: J1.27 TP1.1
V_capB_1: J1.29 TP2.1
V_capC_1: J1.31 TP3.1
VA-Motor1: H1.2(9)
VA-Motor2: H2.2(9)
VB-Motor1: H1.4(10)
VB-Motor2: H2.4(10)
VC-Motor1: H1.6(11)
VC-Motor2: H2.6(11)
VDCA_Out: J1.45 TP8.1
VDCB_Out: J1.09
NetH1_1: H1.1 R24.2
NetH1_11: H1.11(6) R31#2.2
NetH1_12: H1.12(14) R31#2.1
NetH1_15: H1.15(8) R24.1
NetH2_1: H2.1 R25.2
NetH2_11: H2.11(6) R32#2.2
NetH2_12: H2.12(14) R32#2.1
NetH2_15: H2.15(8) R25.1

Not connected (* = marked no-connect by the designer): H1 3(2)* 5(3)* 7(4)* 9(5)*; H2 3(2)* 5(3)* 7(4)* 9(5)*; J2 25 27 29 31 33 37 39 41 42 43 44 45 46 48 49 50; J4 1; J5 1; J6 1; J7 1; J8 1; J9 1; J10 1; J11 1; J12 1

### Notes on the sheet
- 接输出端子
- 接电机端子
- 接到一起
- (near H1) 电机端子
- (near H2) 电机端子
- 编码器端子（绿色），记得画电阻
- 螺栓屏蔽线

### Library data of the parts
H1 H2 = HC-5557-2*8AW: Manufacturer: HCTL(华灿天禄); Add into BOM: yes; Pins Structure: 2x8P; Pitch: 4.2mm; Number of PINs Per Row: 8; Current Rating (Max): 9A; Symbol: HC-5557-2*8AW; Device: HC-5557-2*8AW; LCSC Part Name: 2x8P 间距:4.2mm 弯插; Supplier Part: C2845793; Manufacturer Part: HC-5557-2*8AW; Supplier Footprint: 弯插,P=4.2mm; JLCPCB Part Class: Extended Part; Datasheet: https://atta.szlcsc.com/upload/public/pdf/source/20230620/3AA4118B2C2E81189EA8FE45B17A7E9B.pdf; Supplier: LCSC; Convert to PCB: yes; Mounting Style: 弯插; Reference Series: -; Number of Pins: 16P; Number of Rows: 2; Row Spacing: 4.2mm; Contact Material: 黄铜; Contact Plating: 锡; Operating Temperature Range: -25℃~+85℃
J1 J2 = SHF-125-01-L-D-RA: 50-Pin Simplus Connector; MF: Samtec; MP: SHF-125-01-L-D-RA; Package: None; Price: None; Availability: Unavailable; Value: *
R24 R25 R31#2 R32#2 = 0603 100KΩ (1003) 1%_4: 贴片电阻; Value: 470Ω(1%); ComponentLink1Description: 供应商链接; ComponentLink1URL: http://www.szlcsc.com/product/details_26546.html; Package: 0603; Supplier: LC; SuppliersPartNumber: C25803
TP1-TP9 = PCBTestpoint: 20-313143 PCB Test Point, White, Through Hole Mount, 1.32 mm, Phosphor Bronze, Tin Plated Contacts
TP10 = GroundTestPoint: H2182-01 PCB Test Point, PCB Mount, 1.9 mm, Brass, Tin Plated Contacts

## Sheet bridge.SchDoc
size A1; SheetNumber: 2; SheetTotal: 5
Used 6 times, as channels Inverter?1, Inverter?2, Inverter?3, Inverter?1, Inverter?2, Inverter?3. Parts and nets are listed once, with the designators drawn on the sheet.
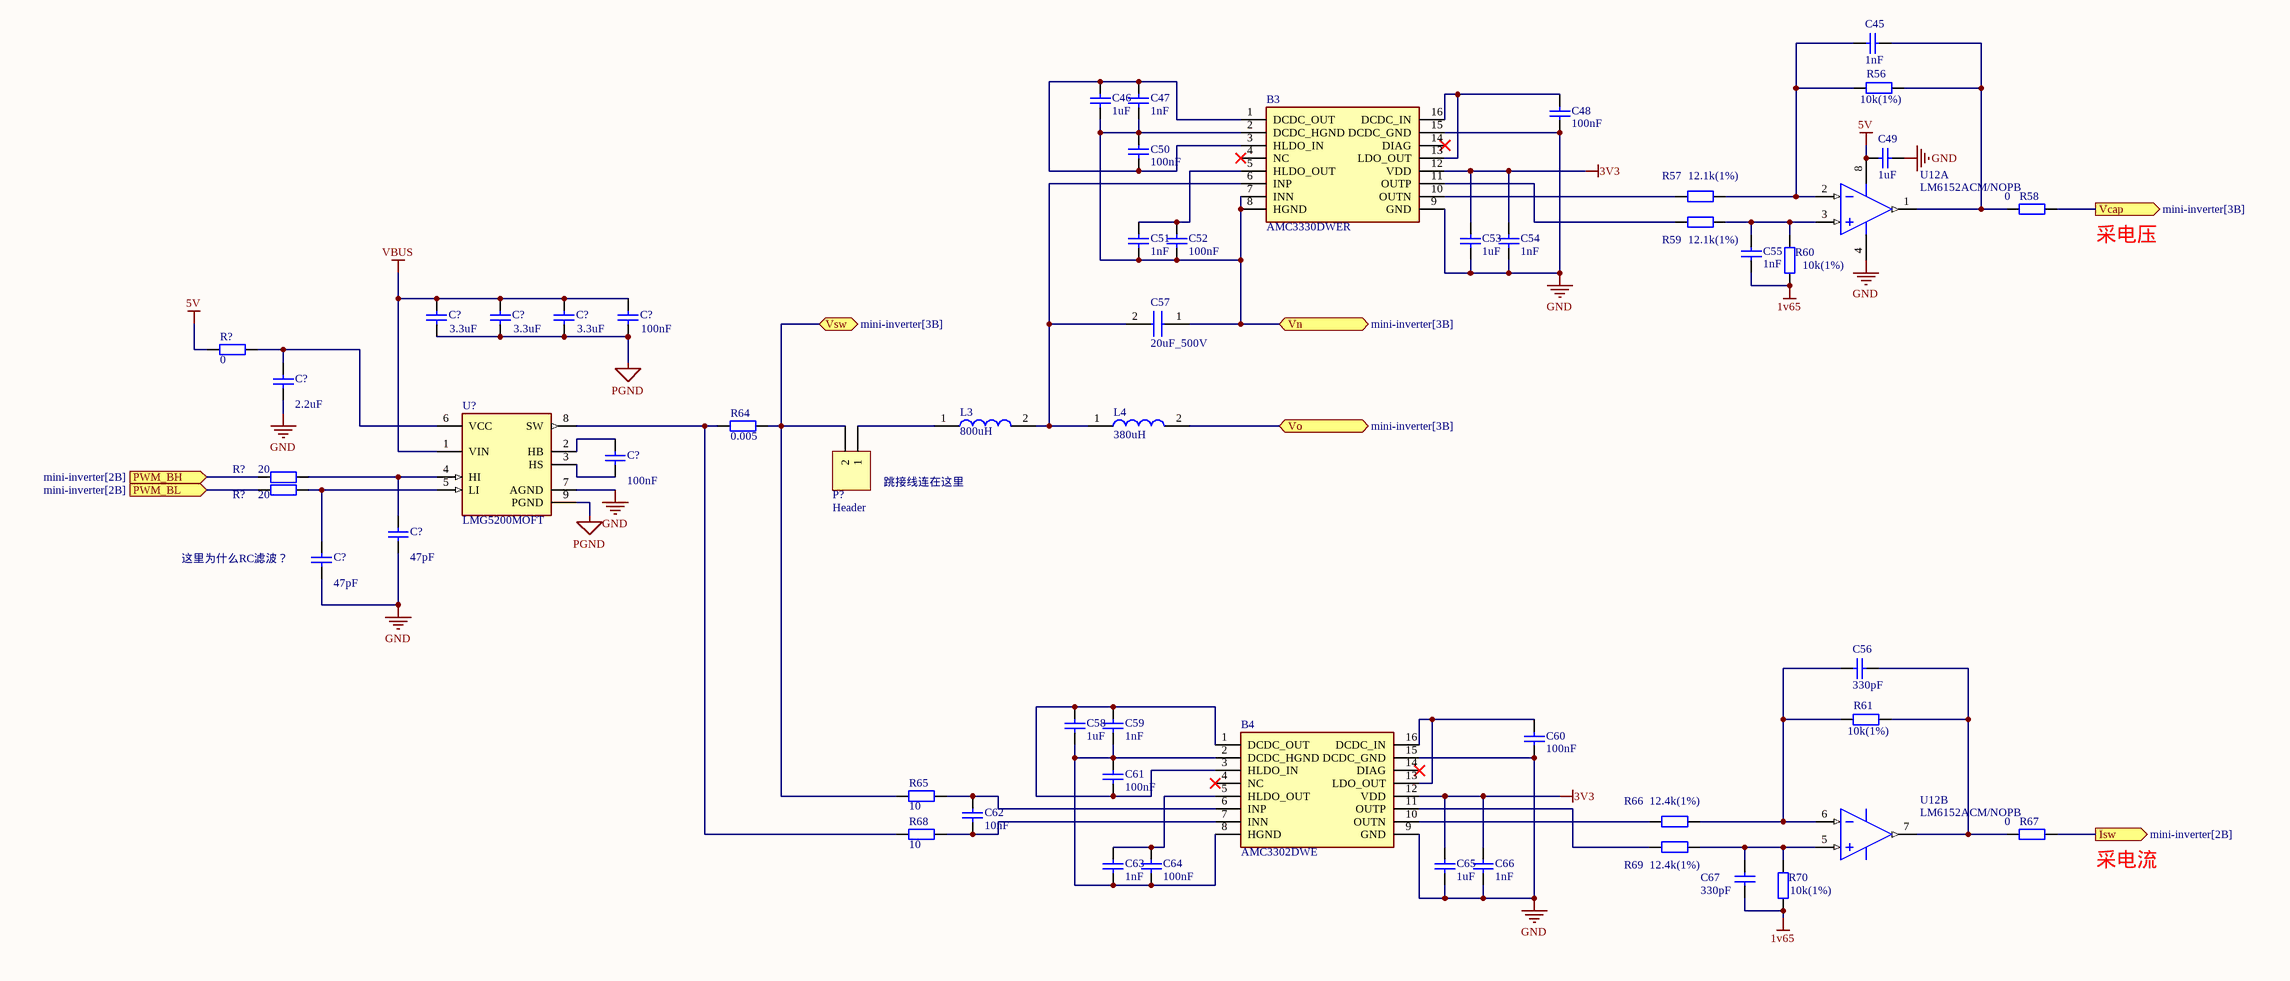
[diagram p8: bridge.SchDoc]

### Parts
(Parts that share a designator on the sheet are numbered #1, #2 ... from top to bottom, then left to right.)
B3  AMC3330DWER  [SOIC127P1030X265-16N]
B4  AMC3302DWE  [SOIC127P1030X265-16N]
C45  1nF  [CAPC1608X06N]
C46  1uF  [CAPC1608X06N]
C47  1nF  [CAPC1608X06N]
C48  100nF  [CAPC1608X06N]
C49  1uF  [CAPC1608X06N]
C50  100nF  [CAPC1608X06N]
C51  1nF  [CAPC1608X06N]
C52  100nF  [CAPC1608X06N]
C53  1uF  [CAPC1608X06N]
C54  1nF  [CAPC1608X06N]
C55  1nF  [CAPC1608X06N]
C56  330pF  [CAPC1608X06N]
C57  20uF_500V  [Film Capacitor PHE450HF7220JR06L2]
C58  1uF  [CAPC1608X06N]
C59  1nF  [CAPC1608X06N]
C60  100nF  [CAPC1608X06N]
C61  100nF  [CAPC1608X06N]
C62  10nF  [CAPC1608X06N]
C63  1nF  [CAPC1608X06N]
C64  100nF  [CAPC1608X06N]
C65  1uF  [CAPC1608X06N]
C66  1nF  [CAPC1608X06N]
C67  330pF  [CAPC1608X06N]
C?#1  100nF  [CAPC1608X06N]
C?#2  3.3uF  [CAPC1608X06N]
C?#3  3.3uF  [CAPC1608X06N]
C?#4  3.3uF  [CAPC1608X06N]
C?#5  2.2uF  [CAPC1608X06N]
C?#6  100nF  [CAPC1608X06N]
C?#7  47pF  [CAPC1608X06N]
C?#8  47pF  [CAPC1608X06N]
L3  800uH  [4mH Custom]
L4  380uH  [380uH Custom]
P?  Header  [HDR1X2]
R56  10k(1%)  [RESC1608X05N]
R57  12.1k(1%)  [RESC1608X05N]
R58  0  [RESC1608X05N]
R59  12.1k(1%)  [RESC1608X05N]
R60  10k(1%)  [RESC1608X05N]
R61  10k(1%)  [RESC1608X05N]
R64  0.005  [RESC1608X05N]
R65  10  [RESC1608X05N]
R66  12.4k(1%)  [RESC1608X05N]
R67  0  [RESC1608X05N]
R68  10  [RESC1608X05N]
R69  12.4k(1%)  [RESC1608X05N]
R70  10k(1%)  [RESC1608X05N]
R?#1  0  [RESC1608X05N]
R?#2  20  [RESC1608X05N]
R?#3  20  [RESC1608X05N]
U12  LM6152ACM/NOPB  [D0008A_L]  (parts A,B of 2)
U?  LMG5200MOFT  [FP-MOF0009A-MFG]

### Ports
Isw (out, see mini-inverter[2B]), PWM_BH (in, see mini-inverter[2B]), PWM_BL (in, see mini-inverter[2B]), Vcap (out, see mini-inverter[3B]), Vn (bidir, see mini-inverter[3B]), Vo (bidir, see mini-inverter[3B]), Vsw (bidir, see mini-inverter[3B])

### Nets
1v65: C55.1 C67.1 R60.1 R70.1
3V3: B3.12(VDD) B4.12(VDD) C53.1 C54.1 C65.1 C66.1
5V: C49.2 R?#1.2 U12.8(V+)
GND: B3.9(GND) B3.15(DCDC_GND) B4.9(GND) B4.15(DCDC_GND) C48.2 C49.1 C53.2 C54.2 C60.2 C65.2 C66.2 C?#5.1 C?#7.2 C?#8.2 U12.4(V-) U?.7(AGND)
PGND: C?#1.2 C?#2.1 C?#3.1 C?#4.1 U?.9(PGND)
VBUS: C?#1.1 C?#2.2 C?#3.2 C?#4.2 U?.1(VIN)
Isw: R67.1 ; port Isw
PWM_BH: R?#2.2 ; port PWM_BH
PWM_BL: R?#3.2 ; port PWM_BL
Vcap: R58.1 ; port Vcap
Vn: B3.2(DCDC_HGND) B3.7(INN) B3.8(HGND) C46.2 C47.2 C50.1 C51.2 C52.2 C57.1 ; port Vn
Vo: L4.2 ; port Vo
Vsw: P?.2 R64.2 R65.1 ; port Vsw
NetB3_1: B3.1(DCDC_OUT) B3.3(HLDO_IN) C46.1 C47.1 C50.2
NetB3_5: B3.5(HLDO_OUT) C51.1 C52.1
NetB3_6: B3.6(INP) C57.2 L3.2 L4.1
NetB3_10: B3.10(OUTN) R57.2
NetB3_11: B3.11(OUTP) R59.1
NetB3_13: B3.13(LDO_OUT) B3.16(DCDC_IN) C48.1
NetB4_1: B4.1(DCDC_OUT) B4.3(HLDO_IN) C58.1 C59.1 C61.2
NetB4_2: B4.2(DCDC_HGND) B4.8(HGND) C58.2 C59.2 C61.1 C63.2 C64.2
NetB4_5: B4.5(HLDO_OUT) C63.1 C64.1
NetB4_6: B4.6(INP) C62.1 R65.2
NetB4_7: B4.7(INN) C62.2 R68.2
NetB4_10: B4.10(OUTN) R66.2
NetB4_11: B4.11(OUTP) R69.1
NetB4_13: B4.13(LDO_OUT) B4.16(DCDC_IN) C60.1
NetC45_1: C45.1 R56.1 R58.2 U12.1(OUTA)
NetC45_2: C45.2 R56.2 R57.1 U12.2(INA-)
NetC55_2: C55.2 R59.2 R60.2 U12.3(INA+)
NetC56_1: C56.1 R61.1 R67.2 U12.7(OUTB)
NetC56_2: C56.2 R61.2 R66.1 U12.6(INB-)
NetC67_2: C67.2 R69.2 R70.2 U12.5(INB+)
NetC?#5_2: C?#5.2 R?#1.1 U?.6(VCC)
NetC?#6_1: C?#6.1 U?.2(HB)
NetC?#6_2: C?#6.2 U?.3(HS)
NetC?#7_1: C?#7.1 R?#2.1 U?.4(HI)
NetC?#8_1: C?#8.1 R?#3.1 U?.5(LI)
NetL3_1: L3.1 P?.1
NetR64_1: R64.1 R68.1 U?.8(SW)

Not connected (* = marked no-connect by the designer): B3 4(NC)* 14(DIAG)*; B4 4(NC)* 14(DIAG)*

### Channels
Inverter?1: designators B3=B3_1 B4=B4_1 C45=C45_1 C46=C46_1 C47=C47_1 C48=C48_1 C49=C49_1 C50=C50_1 C51=C51_1 C52=C52_1 C53=C53_1 C54=C54_1 C55=C55_1 C56=C56_1 C57=C57_1 C58=C58_1 C59=C59_1 C60=C60_1 C61=C61_1 C62=C62_1 C63=C63_1 C64=C64_1 C65=C65_1 C66=C66_1 C67=C67_1 C?=C?_1#6 C?=C?_1#7 C?=C?_1#8 C?=C?_1#5 C?=C?_1#2 C?=C?_1#1 C?=C?_1#3 C?=C?_1#4 L3=L3_1 L4=L4_1 P?=P?_1 R56=R56_1 R57=R57_1 R58=R58_1 R59=R59_1 R60=R60_1 R61=R61_1 R64=R64_1 R65=R65_1 R66=R66_1 R67=R67_1 R68=R68_1 R69=R69_1 R70=R70_1 R?=R?_1#2 R?=R?_1#3 R?=R?_1#1 U12=U12_1 U?=U?_1; ports Isw=NetR67_1_1 PWM_BH=NetR?_1#2_2 PWM_BL=NetR?_1#3_2 Vcap=NetR58_1_1 Vn=NetB3_1_2 Vo=NetL4_1_2 Vsw=NetP?_1_2
Inverter?2: designators B3=B3_2 B4=B4_2 C45=C45_2 C46=C46_2 C47=C47_2 C48=C48_2 C49=C49_2 C50=C50_2 C51=C51_2 C52=C52_2 C53=C53_2 C54=C54_2 C55=C55_2 C56=C56_2 C57=C57_2 C58=C58_2 C59=C59_2 C60=C60_2 C61=C61_2 C62=C62_2 C63=C63_2 C64=C64_2 C65=C65_2 C66=C66_2 C67=C67_2 C?=C?_2#6 C?=C?_2#7 C?=C?_2#8 C?=C?_2#5 C?=C?_2#2 C?=C?_2#1 C?=C?_2#3 C?=C?_2#4 L3=L3_2 L4=L4_2 P?=P?_2 R56=R56_2 R57=R57_2 R58=R58_2 R59=R59_2 R60=R60_2 R61=R61_2 R64=R64_2 R65=R65_2 R66=R66_2 R67=R67_2 R68=R68_2 R69=R69_2 R70=R70_2 R?=R?_2#2 R?=R?_2#3 R?=R?_2#1 U12=U12_2 U?=U?_2; ports Isw=NetR67_1_1 PWM_BH=NetR?_1#2_2 PWM_BL=NetR?_1#3_2 Vcap=NetR58_1_1 Vn=NetB3_1_2 Vo=NetL4_1_2 Vsw=NetP?_1_2
Inverter?3: designators B3=B3_3 B4=B4_3 C45=C45_3 C46=C46_3 C47=C47_3 C48=C48_3 C49=C49_3 C50=C50_3 C51=C51_3 C52=C52_3 C53=C53_3 C54=C54_3 C55=C55_3 C56=C56_3 C57=C57_3 C58=C58_3 C59=C59_3 C60=C60_3 C61=C61_3 C62=C62_3 C63=C63_3 C64=C64_3 C65=C65_3 C66=C66_3 C67=C67_3 C?=C?_3#6 C?=C?_3#7 C?=C?_3#8 C?=C?_3#5 C?=C?_3#2 C?=C?_3#1 C?=C?_3#3 C?=C?_3#4 L3=L3_3 L4=L4_3 P?=P?_3 R56=R56_3 R57=R57_3 R58=R58_3 R59=R59_3 R60=R60_3 R61=R61_3 R64=R64_3 R65=R65_3 R66=R66_3 R67=R67_3 R68=R68_3 R69=R69_3 R70=R70_3 R?=R?_3#2 R?=R?_3#3 R?=R?_3#1 U12=U12_3 U?=U?_3; ports Isw=NetR67_1_1 PWM_BH=NetR?_1#2_2 PWM_BL=NetR?_1#3_2 Vcap=NetR58_1_1 Vn=NetB3_1_2 Vo=NetL4_1_2 Vsw=NetP?_1_2
Inverter?1: designators B3=B3_4 B4=B4_4 C45=C45_4 C46=C46_4 C47=C47_4 C48=C48_4 C49=C49_4 C50=C50_4 C51=C51_4 C52=C52_4 C53=C53_4 C54=C54_4 C55=C55_4 C56=C56_4 C57=C57_4 C58=C58_4 C59=C59_4 C60=C60_4 C61=C61_4 C62=C62_4 C63=C63_4 C64=C64_4 C65=C65_4 C66=C66_4 C67=C67_4 C?=C?_4#6 C?=C?_4#7 C?=C?_4#8 C?=C?_4#5 C?=C?_4#2 C?=C?_4#1 C?=C?_4#3 C?=C?_4#4 L3=L3_4 L4=L4_4 P?=P?_4 R56=R56_4 R57=R57_4 R58=R58_4 R59=R59_4 R60=R60_4 R61=R61_4 R64=R64_4 R65=R65_4 R66=R66_4 R67=R67_4 R68=R68_4 R69=R69_4 R70=R70_4 R?=R?_4#2 R?=R?_4#3 R?=R?_4#1 U12=U12_4 U?=U?_4; ports Isw=NetR67_4_1 PWM_BH=NetR?_4#2_2 PWM_BL=NetR?_4#3_2 Vcap=NetR58_4_1 Vn=NetB3_4_2 Vo=NetL4_4_2 Vsw=NetP?_4_2
Inverter?2: designators B3=B3_5 B4=B4_5 C45=C45_5 C46=C46_5 C47=C47_5 C48=C48_5 C49=C49_5 C50=C50_5 C51=C51_5 C52=C52_5 C53=C53_5 C54=C54_5 C55=C55_5 C56=C56_5 C57=C57_5 C58=C58_5 C59=C59_5 C60=C60_5 C61=C61_5 C62=C62_5 C63=C63_5 C64=C64_5 C65=C65_5 C66=C66_5 C67=C67_5 C?=C?_5#6 C?=C?_5#7 C?=C?_5#8 C?=C?_5#5 C?=C?_5#2 C?=C?_5#1 C?=C?_5#3 C?=C?_5#4 L3=L3_5 L4=L4_5 P?=P?_5 R56=R56_5 R57=R57_5 R58=R58_5 R59=R59_5 R60=R60_5 R61=R61_5 R64=R64_5 R65=R65_5 R66=R66_5 R67=R67_5 R68=R68_5 R69=R69_5 R70=R70_5 R?=R?_5#2 R?=R?_5#3 R?=R?_5#1 U12=U12_5 U?=U?_5; ports Isw=NetR67_4_1 PWM_BH=NetR?_4#2_2 PWM_BL=NetR?_4#3_2 Vcap=NetR58_4_1 Vn=NetB3_4_2 Vo=NetL4_4_2 Vsw=NetP?_4_2
Inverter?3: designators B3=B3_6 B4=B4_6 C45=C45_6 C46=C46_6 C47=C47_6 C48=C48_6 C49=C49_6 C50=C50_6 C51=C51_6 C52=C52_6 C53=C53_6 C54=C54_6 C55=C55_6 C56=C56_6 C57=C57_6 C58=C58_6 C59=C59_6 C60=C60_6 C61=C61_6 C62=C62_6 C63=C63_6 C64=C64_6 C65=C65_6 C66=C66_6 C67=C67_6 C?=C?_6#6 C?=C?_6#7 C?=C?_6#8 C?=C?_6#5 C?=C?_6#2 C?=C?_6#1 C?=C?_6#3 C?=C?_6#4 L3=L3_6 L4=L4_6 P?=P?_6 R56=R56_6 R57=R57_6 R58=R58_6 R59=R59_6 R60=R60_6 R61=R61_6 R64=R64_6 R65=R65_6 R66=R66_6 R67=R67_6 R68=R68_6 R69=R69_6 R70=R70_6 R?=R?_6#2 R?=R?_6#3 R?=R?_6#1 U12=U12_6 U?=U?_6; ports Isw=NetR67_4_1 PWM_BH=NetR?_4#2_2 PWM_BL=NetR?_4#3_2 Vcap=NetR58_4_1 Vn=NetB3_4_2 Vo=NetL4_4_2 Vsw=NetP?_4_2

### Notes on the sheet
- 采电压
- (near P?) 跳接线连在这里
- 这里为什么RC滤波？
- 采电流

### Library data of the parts
B3 = AMC3330DWER: Isolation Amplifiers +/-1-V input, precision reinforced isolated amplifier with integrated DC/DC converter and high CMTI 16-SOIC -40 to 125; Manufacturer_Name: Texas Instruments; Geometry.Height: 2.65mm; Manufacturer_Part_Number: AMC3330DWER; Mouser Part Number: 595-AMC3330DWER; Mouser Price/Stock: https://www.mouser.co.uk/ProductDetail/Texas-Instruments/AMC3330DWER?qs=zW32dvEIR3u5qLqnY17MoA%3D%3D; Arrow Part Number: AMC3330DWER; Arrow Price/Stock: https://www.arrow.com/en/products/amc3330dwer/texas-instruments?region=nac; Datasheet Link: https://www.ti.com/lit/ds/symlink/amc3330.pdf?ts=1627904955935&ref_url=https%253A%252F%252Fwww.ti.com%252Fproduct%252FAMC3330
B4 = AMC3302DWE: Isolation Amplifiers +/-50-mV input, precision reinforced isolated amplifier with integrated DC/DC converter 16-SOIC -40 to 125; Manufacturer_Name: Texas Instruments; Geometry.Height: 2.65mm; Manufacturer_Part_Number: AMC3302DWE; Mouser Part Number: 595-AMC3302DWE; Mouser Price/Stock: https://www.mouser.co.uk/ProductDetail/Texas-Instruments/AMC3302DWE?qs=DRkmTr78QAT3OfY8Rd%252BeWA%3D%3D; Arrow Part Number: AMC3302DWE; Arrow Price/Stock: https://www.arrow.com/en/products/amc3302dwe/texas-instruments?region=nac; Datasheet Link: https://www.ti.com/lit/ds/symlink/amc3302.pdf?ts=1643366130509
C45-C56 C58-C67 C?#1-C?#8 = Cap: Capacitor; Published: 8-Jun-2000; LatestRevisionDate: 17-Jul-2002; LatestRevisionNote: Re-released for DXP Platform.; PackageReference: RAD-0.3; Publisher: Altium Limited; PackageDescription: Radial Cap, Thru-Hole; 2 Leads; 0.3 in Pin Spacing
  C45 C47 C51 C54 C55 C59 C63 C66: Value: 1nF
  C46 C49 C53 C58 C65: Value: 1uF
  C48 C50 C52 C60 C61 C64 C?#1 C?#6: Value: 100nF
  C56 C67: Value: 330pF
  C62: Value: 10nF
  C?#2-C?#4: Value: 3.3uF
  C?#5: Value: 2.2uF
  C?#7 C?#8: Value: 47pF
C57 = PHE450HF7220JR06L2: KEMET PHE450 Metallised Polypropylene Film Capacitor, 180 V ac, 250 V dc, ±5%, 2.2μF, Through Hole; Datasheet Link: https://docs.rs-online.com/a458/0900766b817170df.pdf; Height: 24.5mm; Manufacturer_Name: KEMET; Manufacturer_Part_Number: PHE450HF7220JR06L2
L3 = 4mH Custom Inductor
L4 = 380uH Custom Inductor
P? = Header 2: Header, 2-Pin; LatestRevisionDate: 17-Jul-2002; LatestRevisionNote: Re-released for DXP Platform.; Publisher: Altium Limited
R56-R61 R66 R67 R69 R70 = Res2: Resistor; Published: 8-Jun-2000; LatestRevisionDate: 17-Jul-2002; LatestRevisionNote: Re-released for DXP Platform.; PackageReference: AXIAL-0.4; Publisher: Altium Limited; PackageDescription: Axial Device, Thru-Hole; 2 Leads; 0.4 in Pin Spacing
  R56 R60 R61 R70: Value: 10k(1%)
  R57 R59: Value: 12.1k(1%)
  R58 R67: Value: 0
  R66 R69: Value: 12.4k(1%)
R64 R65 R68 R?#1-R?#3 = 0603 100KΩ (1003) 1%_4: 贴片电阻; Value: 1MΩ(1%); ComponentLink1Description: 供应商链接; ComponentLink1URL: http://www.szlcsc.com/product/details_26546.html; Package: 0603; Supplier: LC; SuppliersPartNumber: C25803
U12 = LM6152ACM/NOPB: Dual and Quad 75 MHz GBW Rail-to-Rail I/O Operational Amplifiers, 8-pin Narrow SOIC, Pb-Free; Manufacturer: Texas Instruments; PackageTopMarking: NSZXTT*LM61*52ACM; PowerWise: Y; Package Reference: D0008A; Code_JEDEC: MS-012-AA; Code_IPC: SOIC127P600-8; PinCount: 8; ComponentLink1URL: http://www.ti.com/general/docs/lit/getliterature.tsp?genericPartNumber=LM6152&fileType=pdf; PackageDescription: SOIC Narrow, 4.9 x 3.9 x 1.45mm, 8 Lead, 1.27mm Pitch; CompType: Amplifiers; RoHS: Y; ComponentLink1Description: Datasheet URL
U? = CMP-04912-000022-2: None; Output Current per Channel: 10A; Interface: Logic; Min Operating Temperature: -40°C; Mount: Surface Mount; Case/Package: QFN; RoHS Compliant: Yes; Packaging: Cut Tape; Max Operating Temperature: 125°C; Number of Pins: 9

## Nets that join several sheets
1v65: Inverter?1 (C55_1.1 C67_1.1 R60_1.1 R70_1.1), Inverter?2 (C55_2.1 C67_2.1 R60_2.1 R70_2.1), Inverter?3 (C55_3.1 C67_3.1 R60_3.1 R70_3.1), Inverter?1 (C55_4.1 C67_4.1 R60_4.1 R70_4.1), Inverter?2 (C55_5.1 C67_5.1 R60_5.1 R70_5.1), Inverter?3 (C55_6.1 C67_6.1 R60_6.1 R70_6.1)
3V3: power (J13.1 R95.2 R99.2 R100.2), protection (8 pins), pwm-enable (24 pins), Inverter?1 (6 pins), Inverter?2 (6 pins), Inverter?3 (6 pins), Inverter?1 (6 pins), Inverter?2 (6 pins), Inverter?3 (6 pins)
5V: power (11 pins), mini-inverter (H1.8 H2.8), Inverter?1 (C49_1.2 R?_1#1.2 U12_1.8), Inverter?2 (C49_2.2 R?_2#1.2 U12_2.8), Inverter?3 (C49_3.2 R?_3#1.2 U12_3.8), Inverter?1 (C49_4.2 R?_4#1.2 U12_4.8), Inverter?2 (C49_5.2 R?_5#1.2 U12_5.8), Inverter?3 (C49_6.2 R?_6#1.2 U12_6.8)
CompRef: power (C109.1 R97.1 R98.2), protection (U17#1.4 U19.4 U20.4)
GND: power (29 pins), protection (11 pins), pwm-enable (60 pins), mini-inverter (55 pins), Inverter?1 (16 pins), Inverter?2 (16 pins), Inverter?3 (16 pins), Inverter?1 (16 pins), Inverter?2 (16 pins), Inverter?3 (16 pins)
PGND: power (6 pins), Inverter?1 (5 pins), Inverter?2 (5 pins), Inverter?3 (5 pins), Inverter?1 (5 pins), Inverter?2 (5 pins), Inverter?3 (5 pins)
VBUS: power (6 pins), Inverter?1 (5 pins), Inverter?2 (5 pins), Inverter?3 (5 pins), Inverter?1 (5 pins), Inverter?2 (5 pins), Inverter?3 (5 pins)
NetB3_1_2: Inverter?1 (9 pins), Inverter?2 (9 pins), Inverter?3 (9 pins)
NetB3_4_2: Inverter?1 (9 pins), Inverter?2 (9 pins), Inverter?3 (9 pins)
NetL4_1_2: Inverter?1 (L4_1.2), Inverter?2 (L4_2.2), Inverter?3 (L4_3.2)
NetL4_4_2: Inverter?1 (L4_4.2), Inverter?2 (L4_5.2), Inverter?3 (L4_6.2)
NetP?_1_2: Inverter?1 (P?_1.2 R64_1.2 R65_1.1), Inverter?2 (P?_2.2 R64_2.2 R65_2.1), Inverter?3 (P?_3.2 R64_3.2 R65_3.1)
NetP?_4_2: Inverter?1 (P?_4.2 R64_4.2 R65_4.1), Inverter?2 (P?_5.2 R64_5.2 R65_5.1), Inverter?3 (P?_6.2 R64_6.2 R65_6.1)
NetR58_1_1: Inverter?1 (R58_1.1), Inverter?2 (R58_2.1), Inverter?3 (R58_3.1)
NetR58_4_1: Inverter?1 (R58_4.1), Inverter?2 (R58_5.1), Inverter?3 (R58_6.1)
NetR67_1_1: Inverter?1 (R67_1.1), Inverter?2 (R67_2.1), Inverter?3 (R67_3.1)
NetR67_4_1: Inverter?1 (R67_4.1), Inverter?2 (R67_5.1), Inverter?3 (R67_6.1)
NetR?_1#2_2: Inverter?1 (R?_1#2.2), Inverter?2 (R?_2#2.2), Inverter?3 (R?_3#2.2)
NetR?_1#3_2: Inverter?1 (R?_1#3.2), Inverter?2 (R?_2#3.2), Inverter?3 (R?_3#3.2)
NetR?_4#2_2: Inverter?1 (R?_4#2.2), Inverter?2 (R?_5#2.2), Inverter?3 (R?_6#2.2)
NetR?_4#3_2: Inverter?1 (R?_4#3.2), Inverter?2 (R?_5#3.2), Inverter?3 (R?_6#3.2)